# EAGLE schematic c64-uni-cart (EAGLE 9.5.2)
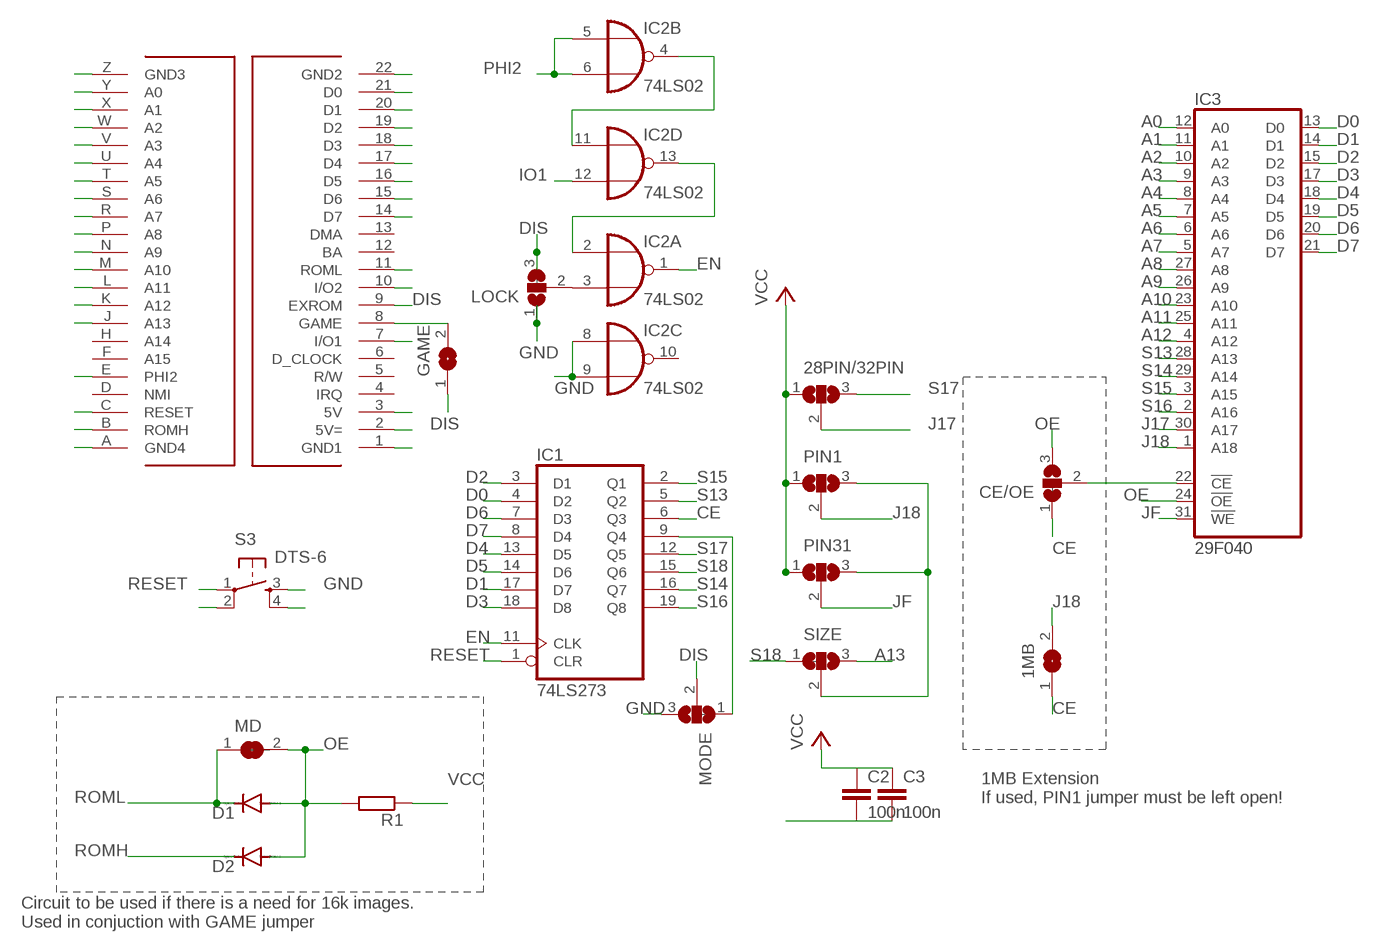
[diagram p0: schematic, sheet 1]

## Parts
1MB  SJ  [SJ]
28PIN/32PIN  SJ2W  [SJ_2]
C2  100n  C-EU025-024X044  [C025-024X044]
C3  100n  C-EU025-024X044  [C025-024X044]
CE/OE  SJ2W  [SJ_2]
D1  DIODE-MINIMELF  [MINIMELF]
D2  DIODE-MINIMELF  [MINIMELF]
GAME  SJ  [SJ]
IC1  74LS273  74HCT273N  [DIL20]
IC2  74LS02  74LS02N  [DIL14]
IC3  29F040  AM29F040N  [DIL32-6]
LOCK  SJ2W  [SJ_2]
MD  SJ  [SJ]
MODE  SJ2W  [SJ_2]
PIN1  SJ2W  [SJ_2]
PIN31  SJ2W  [SJ_2]
R1  R-EU_R1206  [R1206]
S3  DTS-6  [DTS-6]
SIZE  SJ2W  [SJ_2]
U$1  C64_CARTRIDGESTUMPY  [C64_STUMPY]

## Nets
A0: IC3.12(A0) U$1.Y(A0)
A1: IC3.11(A1) U$1.X(A1)
A2: IC3.10(A2) U$1.W(A2)
A3: IC3.9(A3) U$1.V(A3)
A4: IC3.8(A4) U$1.U(A4)
A5: IC3.7(A5) U$1.T(A5)
A6: IC3.6(A6) U$1.S(A6)
A7: IC3.5(A7) U$1.R(A7)
A8: IC3.27(A8) U$1.P(A8)
A9: IC3.26(A9) U$1.N(A9)
A10: IC3.23(A10) U$1.M(A10)
A11: IC3.25(A11) U$1.L(A11)
A12: IC3.4(A12) U$1.K(A12)
A13: SIZE.3 U$1.J(A13)
CE: 1MB.1 CE/OE.1 IC1.6(Q3)
D0: IC1.4(D2) IC3.13(D0) U$1.21(D0)
D1: IC1.17(D7) IC3.14(D1) U$1.20(D1)
D2: IC1.3(D1) IC3.15(D2) U$1.19(D2)
D3: IC1.18(D8) IC3.17(D3) U$1.18(D3)
D4: IC1.13(D5) IC3.18(D4) U$1.17(D4)
D5: IC1.14(D6) IC3.19(D5) U$1.16(D5)
D6: IC1.7(D3) IC3.20(D6) U$1.15(D6)
D7: IC1.8(D4) IC3.21(D7) U$1.14(D7)
DIS: GAME.1 LOCK.3 MODE.2 U$1.9(EXROM)
EN: IC1.11(CLK) IC2.1(A:O)
GND: C2.2 C3.2 IC2.8(C:I0) IC2.9(C:I1) LOCK.1 MODE.3 S3.3 S3.4 U$1.1(GND1) U$1.22(GND2) U$1.A(GND4) U$1.Z(GND3)
IO1: IC2.12(D:I1) U$1.7(I/O1)
IO2: U$1.10(I/O2)
J17: 28PIN/32PIN.2 IC3.30(A17)
J18: 1MB.2 IC3.1(A18) PIN1.2
JF: IC3.31(!WE) PIN31.2
N$1: GAME.2 U$1.8(GAME)
N$2: IC2.3(A:I1) LOCK.2
N$4: CE/OE.2 IC3.22(!CE)
N$5: PIN1.3 PIN31.3 SIZE.2
N$6: IC1.9(Q4) MODE.1
N$7: IC2.4(B:O) IC2.11(D:I0)
N$9: IC2.2(A:I0) IC2.13(D:O)
OE: CE/OE.3 D1.A D2.A IC3.24(!OE) MD.2 R1.2
PHI2: IC2.5(B:I0) IC2.6(B:I1) U$1.E(PHI2)
RESET: IC1.1(CLR) S3.1 S3.2 U$1.C(RESET)
ROMH: D2.C U$1.B(ROMH)
ROML: D1.C MD.1 U$1.11(ROML)
S13: IC1.5(Q2) IC3.28(A13)
S14: IC1.16(Q7) IC3.29(A14)
S15: IC1.2(Q1) IC3.3(A15)
S16: IC1.19(Q8) IC3.2(A16)
S17: 28PIN/32PIN.3 IC1.12(Q5)
S18: IC1.15(Q6) SIZE.1
VCC: 28PIN/32PIN.1 C2.1 C3.1 PIN1.1 PIN31.1 R1.1 U$1.2(5V=) U$1.3(5V)
Unconnected: IC2.10(C:O) U$1.4(IRQ) U$1.5(R/W) U$1.6(D_CLOCK) U$1.12(BA) U$1.13(DMA) U$1.D(NMI) U$1.F(A15) U$1.H(A14)

## Notes on the sheet
- 1MB Extension
  If used, PIN1 jumper must be left open!
- Circuit to be used if there is a need for 16k images.
  Used in conjuction with GAME jumper

## Power pins joined to a net without a drawn wire
GND: IC1.10(GND) IC2.7(P:GND) IC3.16(GND)
VCC: IC1.20(VCC) IC2.14(P:VCC) IC3.32(VCC)

## Library data of the parts
1MB GAME MD = jumper:SJ: SMD solder JUMPER
28PIN/32PIN CE/OE LOCK MODE PIN1 PIN31 SIZE = jumper:SJ2W: SMD solder JUMPER
C2 C3 = rcl:C-EU: CAPACITOR, European symbol
D1 D2 = diode:DIODE-: DIODE
IC1 = 74xx-eu:74*273: Octal D type FLIP FLOP, clear
IC2 = 74xx-eu:74*02: Quad 2-input NOR gate
IC3 = 0RB_Memory:AM29F040: 4-Megabit FLASH MEMORY (512 K x 8 bit) 5 V-only
R1 = rcl:R-EU_: RESISTOR, European symbol; SPICEPREFIX: R
S3 = switch-tact:DTS-6
U$1 = 64kb_cart-twoboxes-short:C64_CARTRIDGE